# EAGLE design RJ11-Breakout (EAGLE 7.6.0)
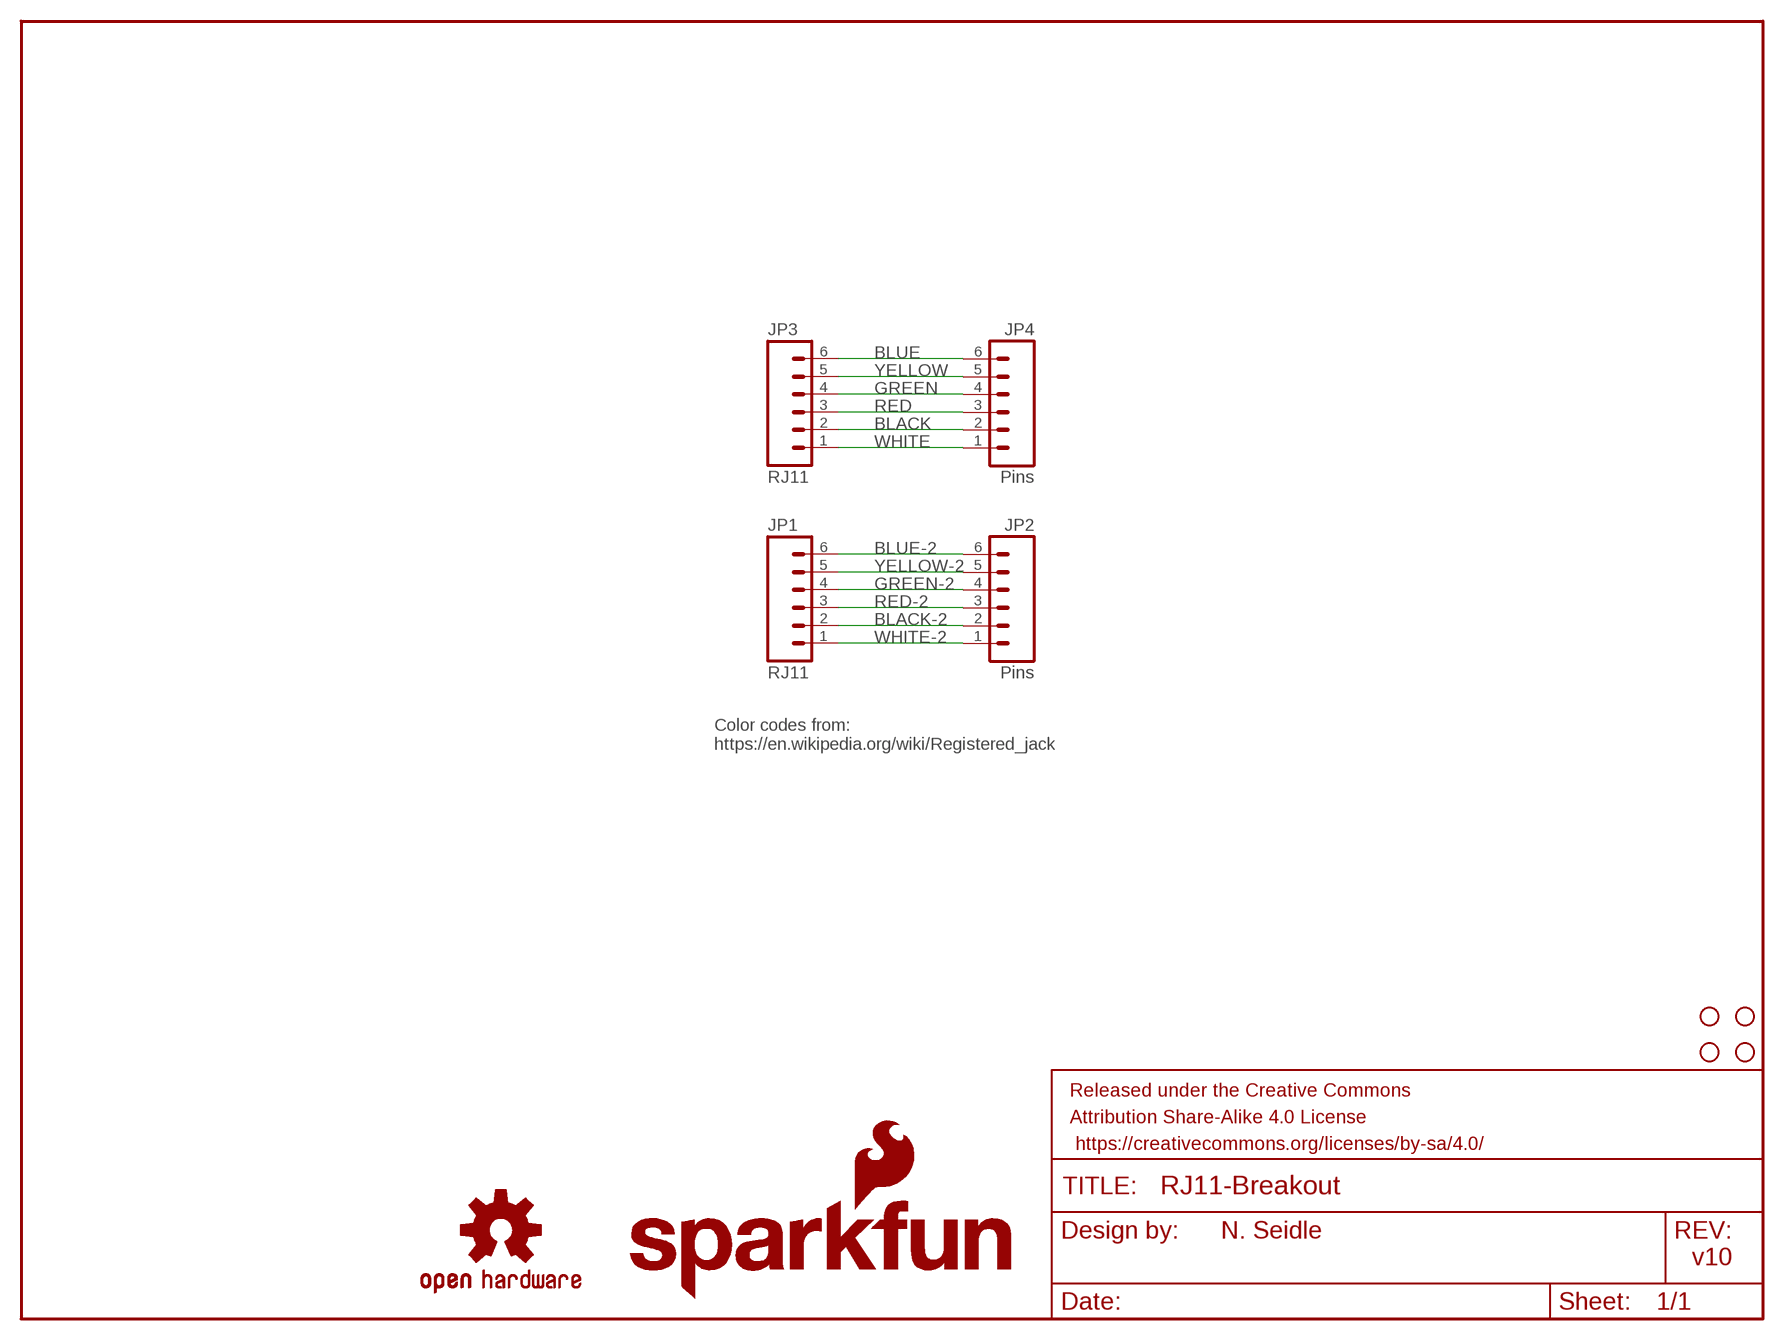
[diagram p0: schematic, sheet 1]

## Parts
FRAME2  FRAME-LETTER  [CREATIVE_COMMONS]
H1  STAND-OFF  [STAND-OFF]
H2  STAND-OFF  [STAND-OFF]
H3  STAND-OFF  [STAND-OFF]
H4  STAND-OFF  [STAND-OFF]
JP1  RJ11  RJ11-6PTH  [RJ11-6]
JP2  Pins  M06SILK_FEMALE_PTH  [1X06]
JP3  RJ11  RJ11-6PTH  [RJ11-6]
JP4  Pins  M06SILK_FEMALE_PTH  [1X06]
LOGO1  SFE_LOGO_NAME_FLAME.1_INCH  [SFE_LOGO_NAME_FLAME_.1]
LOGO2  SFE_LOGO_NAME_FLAME.1_INCH  [SFE_LOGO_NAME_FLAME_.1]
LOGO3  OSHW-LOGOMINI  [OSHW-LOGO-MINI]
LOGO4  SFE_LOGO_NAME_FLAME.1_INCH  [SFE_LOGO_NAME_FLAME_.1]
LOGO5  SFE_LOGO_NAME_FLAME.1_INCH  [SFE_LOGO_NAME_FLAME_.1]
LOGO6  OSHW-LOGOMINI  [OSHW-LOGO-MINI]

## Nets
BLACK: JP3.2 JP4.2
BLACK-2: JP1.2 JP2.2
BLUE: JP3.6 JP4.6
BLUE-2: JP1.6 JP2.6
GREEN: JP3.4 JP4.4
GREEN-2: JP1.4 JP2.4
RED: JP3.3 JP4.3
RED-2: JP1.3 JP2.3
WHITE: JP3.1 JP4.1
WHITE-2: JP1.1 JP2.1
YELLOW: JP3.5 JP4.5
YELLOW-2: JP1.5 JP2.5

## Notes on the sheet
- Color codes from:
  https://en.wikipedia.org/wiki/Registered_jack
- N. Seidle
- v10

## Library data of the parts
FRAME2 = SparkFun-Aesthetics:FRAME-LETTER: Schematic Frame Standard 8.5x11 US Letter frame
H1-H4 = SparkFun-Electromechanical:STAND-OFF: #4 Stand Off This is the mechanical footprint for a #4 phillips button head screw. Use the keepout ring to avoid running the screw head into surrounding components. SKU : PRT-00447
JP1 JP3 = SparkFun-Connectors:RJ11-6: RJ11 Jack Simple 6 pin RJ11 jack. Commonly found on CAT3 devices and Microchip programmers. SKU: PRT-00132; PROD_ID: CONN-08590
JP2 JP4 = SparkFun-Connectors:M06: Header 6 Standard 6-pin 0.1" header. Use with straight break away headers (SKU : PRT-00116), right angle break away headers (PRT-00553), swiss pins (PRT-00743), machine pins (PRT-00117), and female headers (PRT-00115). Molex polarized connector foot print use with SKU : PRT-08094 with associated crimp pins and housings. NOTES ON THE VARIANTS LOCK and LOCK_LONGPADS... This footprint was designed to help hold the alignment of a through-hole component (i.e. 6-pin header) while soldering it into place. You may notice that each hole has been shifted either up or down by 0.005 of an inch from it's more standard position (which is a perfectly straight line). This slight alteration caused the pins (the squares in the middle) to touch the edges of the holes. Because they are alternating, it causes a "brace" to hold the component in place. 0.005 has proven to be the perfect amount of "off-center" position when using our standard breakaway headers. Although looks a little odd when you look at the bare footprint, once you have a header in there, the alteration is very hard to notice. Also,if you push a header all the way into place, it is covered up entirely on the bottom side. This idea of altering the position of holes to aid alignment will be further integrated into the Sparkfun Library for other footprints. It can help hold any component with 3 or more connection pins.; PROD_ID: CONN-08437
LOGO1 LOGO2 LOGO4 LOGO5 = SparkFun-Aesthetics:SFE_LOGO_NAME_FLAME: SFE Logo, name and flame This is the SparkFun full logo. The logo on the schematic will always be the same size; the package variant is the height of the flame part of the logo. Default layer for the logo on the board is tSilk.
LOGO3 LOGO6 = SparkFun-Aesthetics:OSHW-LOGO: Open Source Hardware Logo This logo indicates the piece of hardware it is found on incorporates a OSHW license and/or adheres to the definition of open source hardware found here: http://freedomdefined.org/OSHW

## Net classes
0 default: width 0.203 mm

## Board
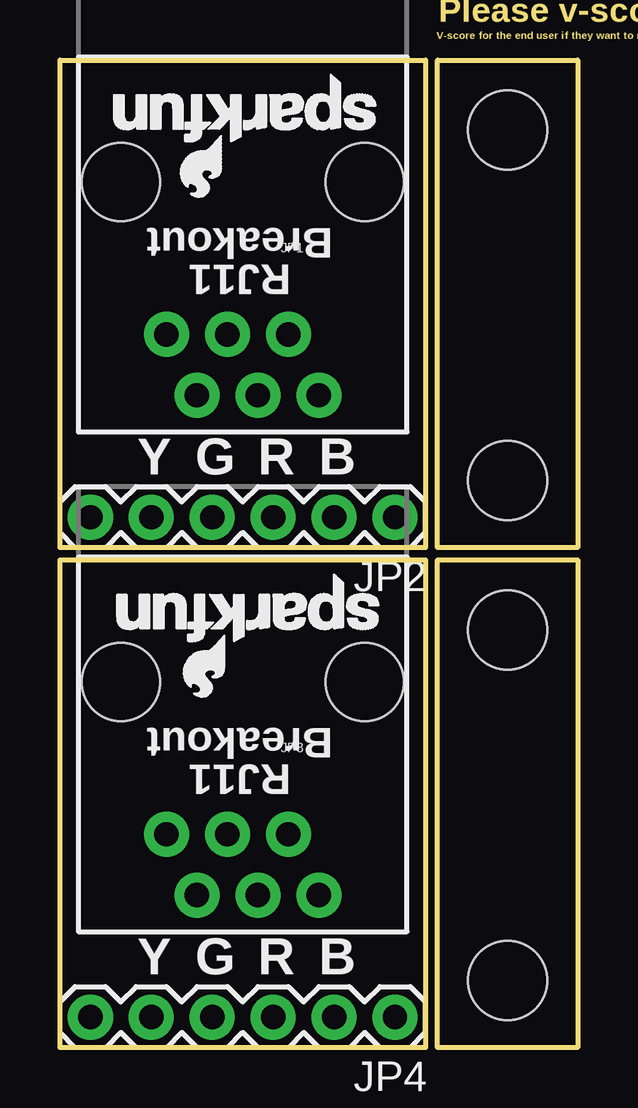
[diagram p1: board, top side]
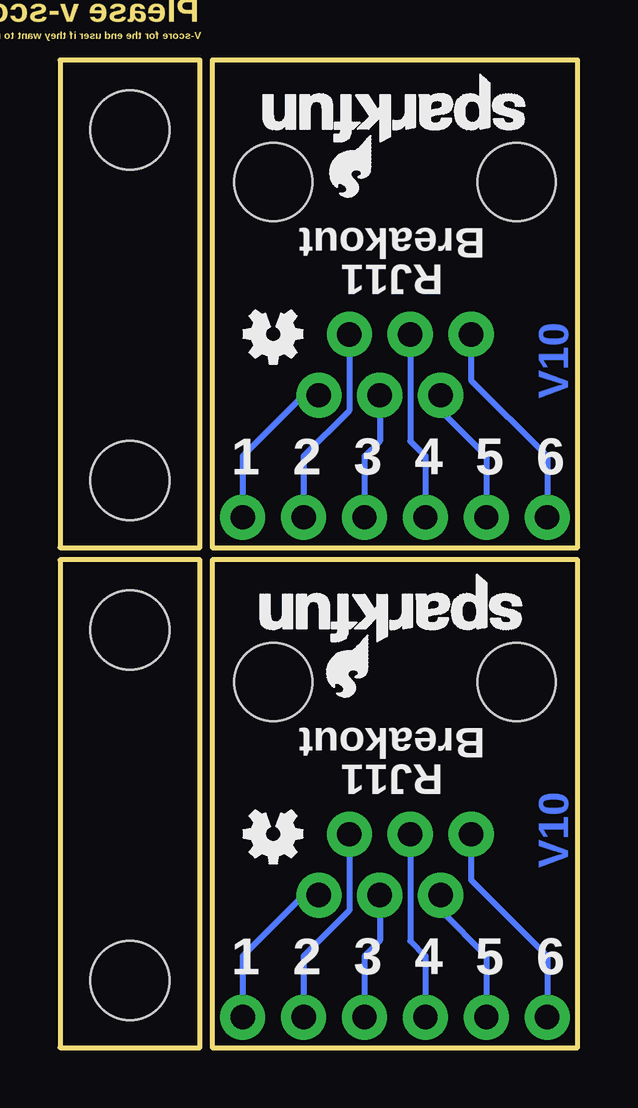
[diagram p2: board, bottom side, seen from below]

Size 21.59 x 41.15 mm. Coordinates in mm from the lower left corner, seen from the top.
Outline: 15.24,20.83 0,20.83 0,41.15 15.24,41.15 15.24,20.83
Outline: 15.75,41.15 21.59,41.15 21.59,20.83 15.75,20.83 15.75,41.15
Outline: 0,0 0,20.32 15.24,20.32 15.24,0 0,0
Outline: 15.75,20.32 21.59,20.32 21.59,0 15.75,0 15.75,20.32
Copper layers (1*16): Top 0.035mm / dielectric 1.5mm / Bottom 0.035mm
Design rules "SparkFun-2-layer-STANDARD": minimum track width 10mil, minimum drill 20mil, track to track 10mil, track to pad 8mil, pad to pad 8mil, via to via 10mil, smd to smd 8mil, copper to edge 8mil, drill to drill 8mil, minimum pad ring 10mil, minimum via ring 10mil, stop-mask expansion 4mil, vias tented up to drill 20mil, thermal gap 10mil

### Footprints (pad centres in the part's own frame; a part is rotated, then mirrored left to right if it is on the bottom)
STAND-OFF = hole 3.302: 0,0
RJ11-6 = drill 1.016 pad 1.88: 1 -3.175,8.89; 2 -1.905,6.35; 3 -0.635,8.89; 4 0.635,6.35; 5 1.905,8.89; 6 3.175,6.35 | hole 3.251: -5.08,0; 5.08,0
1X06 = drill 1.016 pad 1.88: 1 0,0; 2 2.54,0; 3 5.08,0; 4 7.62,0; 5 10.16,0; 6 12.7,0

### Placement (x,y rotation side)
FRAME2  -12.7,-12.7 0 top  (outside the outline)
H1  18.67,23.62 0 top
H2  18.67,17.4 0 top
H3  18.67,38.23 0 top
H4  18.67,2.79 0 top
JP1  7.62,36.07 180 top
JP2  13.97,22.1 180 top
JP3  7.62,15.24 180 top
JP4  13.97,1.27 180 top
LOGO1  1.78,40.64 180 bottom
LOGO2  13.59,40.64 180 top
LOGO3  12.7,29.72 180 bottom
LOGO4  13.72,19.81 180 top
LOGO5  1.91,19.81 180 bottom
LOGO6  12.7,8.89 180 bottom

### Tracks (layer width: path | path; a pad name or v marks a point on that pad's centre or on a via)
BLACK
  Bottom 0.254: JP3.2 9.53,5.71 11.43,3.81 JP4.2
BLACK-2
  Bottom 0.254: JP1.2 9.53,26.54 11.43,24.64 JP2.2
BLUE
  Bottom 0.254: JP3.6 4.45,6.99 1.27,3.81 JP4.6
BLUE-2
  Bottom 0.254: JP1.6 4.45,27.81 1.27,24.64 JP2.6
GREEN
  Bottom 0.254: JP3.4 6.99,4.45 6.35,3.81 JP4.4
GREEN-2
  Bottom 0.254: JP1.4 6.99,25.27 6.35,24.64 JP2.4
RED
  Bottom 0.254: JP3.3 8.26,4.45 8.89,3.81 JP4.3
RED-2
  Bottom 0.254: JP1.3 8.26,25.27 8.89,24.64 JP2.3
WHITE
  Bottom 0.254: JP3.1 11.43,6.35 13.97,3.81 JP4.1
WHITE-2
  Bottom 0.254: JP1.1 11.43,27.18 13.97,24.64 JP2.1
YELLOW
  Bottom 0.254: JP3.5 5.71,5.71 3.81,3.81 JP4.5
YELLOW-2
  Bottom 0.254: JP1.5 5.71,26.54 3.81,24.64 JP2.5

### Text on the board
Bottom: V10 | V10
Dimension: Please v-score | V-score for the end user if they want to remove
tPlace: Breakout | RJ11 | Y | G | R | B | Breakout | RJ11 | Y | G | R | B
bPlace: Breakout | RJ11 | 6 | 5 | 4 | 3 | 2 | 1 | Breakout | RJ11 | 6 | 5 | 4 | 3 | 2 | 1
Measures: All dimensions are in inches.
tDocu: N. Seidle